# EAGLE design max30105_iiT (EAGLE 7.7.0)
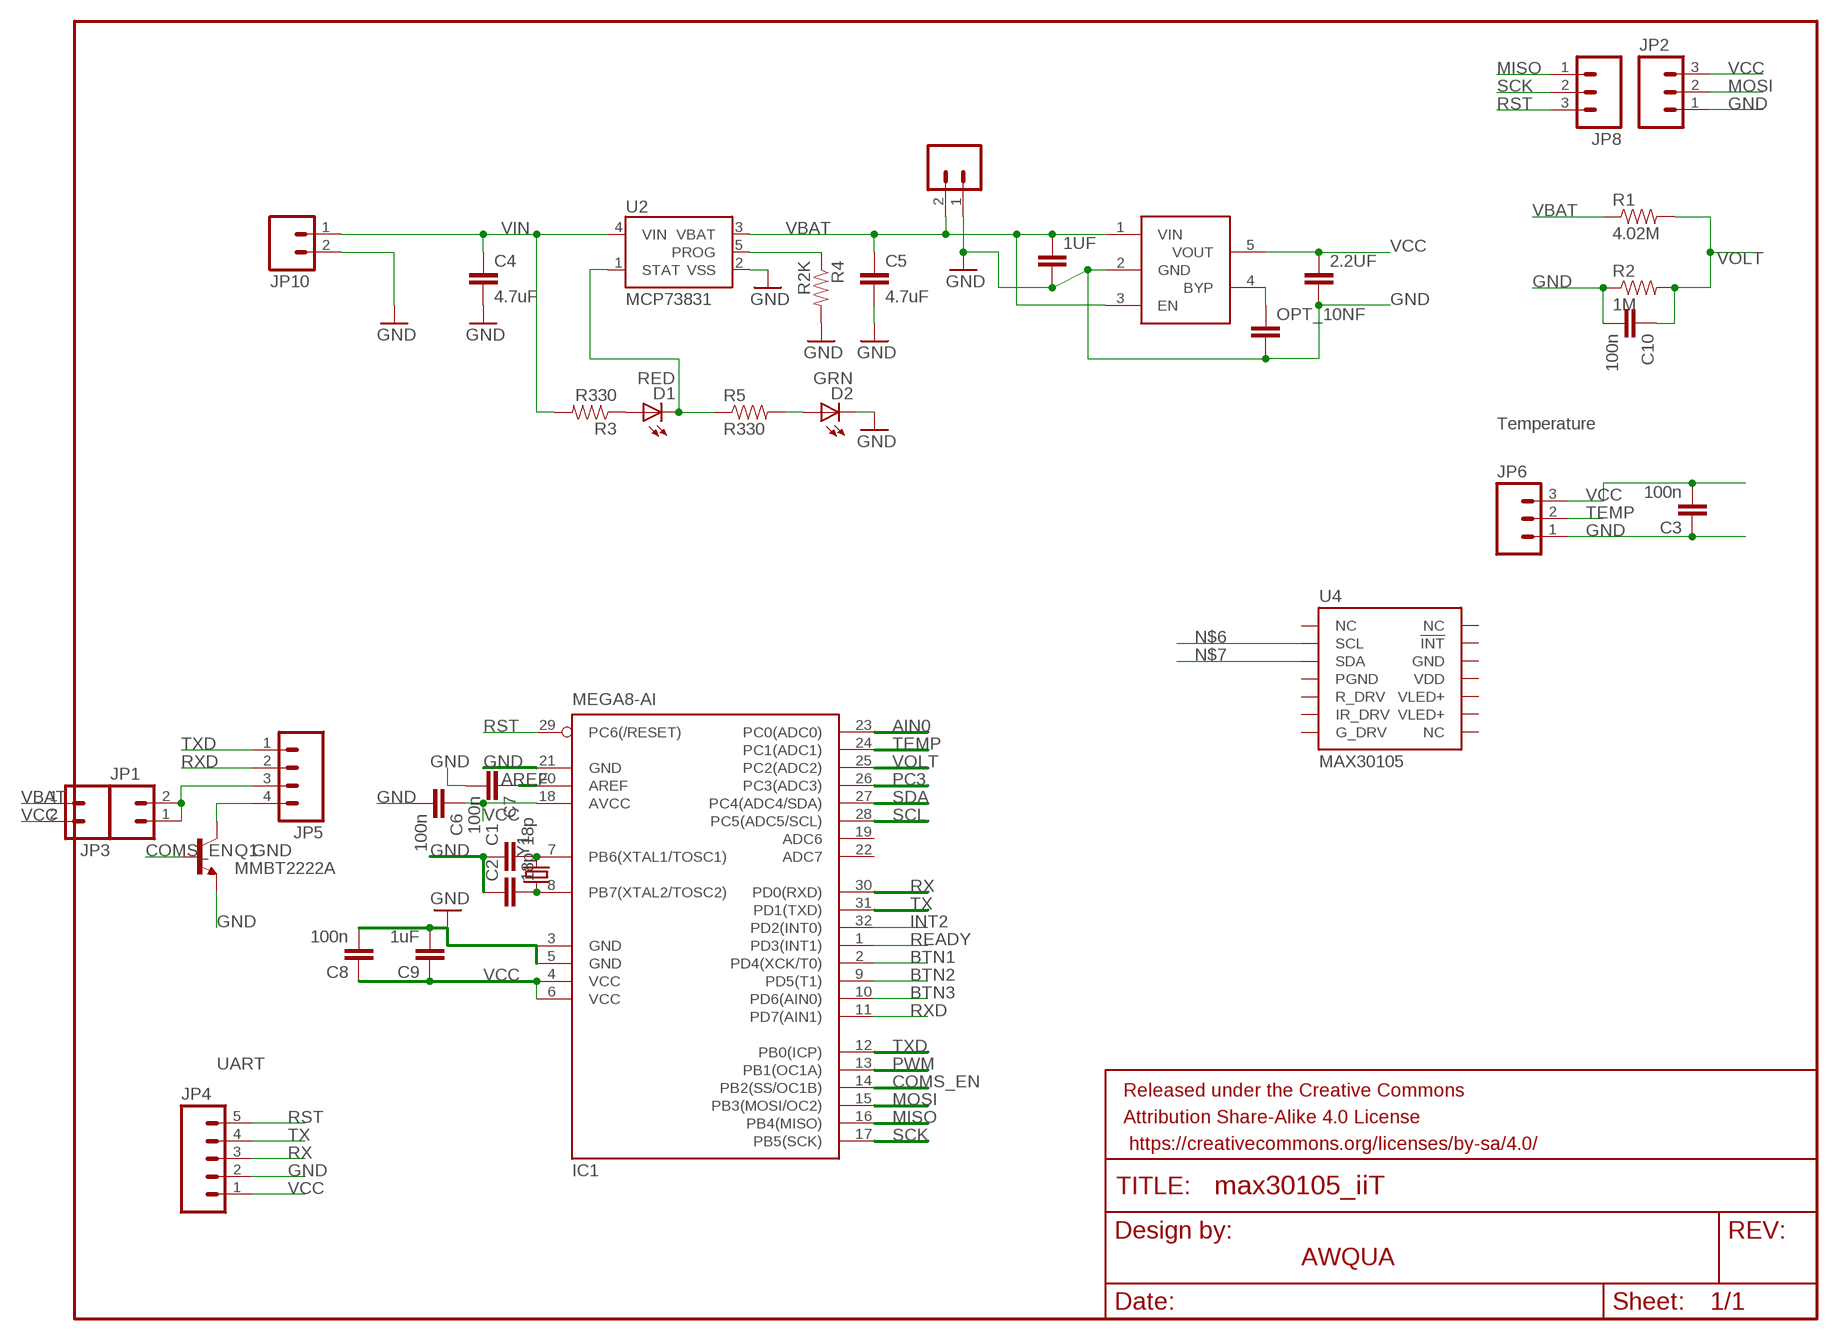
[diagram p0: schematic, sheet 1]

## Parts
1UF  CAP0603-CAP  [0603-CAP]
2.2UF  CAP0603-CAP  [0603-CAP]
C1  18p  CAP0603-CAP  [0603-CAP]
C2  18p  CAP0603-CAP  [0603-CAP]
C3  100n  CAP0603-CAP  [0603-CAP]
C4  4.7uF  CAP0402-CAP  [0402-CAP]
C5  4.7uF  CAP0402-CAP  [0402-CAP]
C6  100n  CAP0603-CAP  [0603-CAP]
C7  100n  CAP0603-CAP  [0603-CAP]
C8  100n  CAP0603-CAP  [0603-CAP]
C9  1uF  CAP0603-CAP  [0603-CAP]
C10  100n  CAP0603-CAP  [0603-CAP]
D1  RED  LED0603  [LED-0603]
D2  GRN  LED0603  [LED-0603]
FRAME1  FRAME-LETTER  [CREATIVE_COMMONS]
IC1  MEGA8-AI  [TQFP32-08]
JP1  M02PTH  [1X02]
JP2  M03PTH  [1X03]
JP3  M02PTH  [1X02]
JP4  M05PTH  [1X05]
JP5  M04PTH  [1X04]
JP6  M03PTH  [1X03]
JP7  LiPo Battery  M02-JST-2MM-SMT  [JST-2-SMD]
JP8  M03PTH  [1X03]
JP10  M02PTH  [1X02]
OPT_10NF  CAP0603-CAP  [0603-CAP]
Q1  MMBT2222A  TRANSISTOR_NPNMMBT2222A  [SOT23-3]
R1  4.02M  RESISTOR0603  [0603-RES]
R2  1M  RESISTOR0603  [0603-RES]
R3  R330  RESISTOR0402-RES  [0402-RES]
R4  R2K  RESISTOR0402-RES  [0402-RES]
R5  R330  RESISTOR0402-RES  [0402-RES]
U2  MCP73831  [SOT23-5]
U4  MAX30105  MAX30105SMD  [OLGA-14]
U$6  LP2985  [LP2985]
Y1  CRYSTAL5X3  [CRYSTAL-SMD-5X3]

## Nets
AIN0: IC1.23(PC0(ADC0))
AREF: C7.1 IC1.20(AREF)
BTN1: IC1.2(PD4(XCK/T0))
BTN2: IC1.9(PD5(T1))
BTN3: IC1.10(PD6(AIN0))
COMS_EN: IC1.14(PB2(SS/OC1B)) Q1.1(B)
GND: 1UF.2 2.2UF.2 C1.1 C2.1 C3.1 C4.2 C5.2 C6.2 C7.2 C8.2 C9.2 C10.2 D2.C IC1.3(GND) IC1.5(GND) IC1.21(GND) JP2.1 JP4.2 JP5.4 JP6.1 JP7.1 JP10.2 OPT_10NF.2 Q1.2(E) Q1.3(C) R2.1 R4.2 U2.2(VSS) U$6.2(GND)
INT2: IC1.32(PD2(INT0))
MISO: IC1.16(PB4(MISO)) JP8.1
MOSI: IC1.15(PB3(MOSI/OC2)) JP2.2
N$1: D1.A R3.1
N$2: OPT_10NF.1 U$6.4(BYP)
N$3: JP1.1 JP1.2 JP5.3
N$5: D2.A R5.2
N$6: U4.2(SCL)
N$7: U4.3(SDA)
PC3: IC1.26(PC3(ADC3))
PROG: R4.1 U2.5(PROG)
PWM: IC1.13(PB1(OC1A))
Q1: C2.2 IC1.8(PB7(XTAL2/TOSC2)) Y1.1
Q2: C1.2 IC1.7(PB6(XTAL1/TOSC1)) Y1.3
READY: IC1.1(PD3(INT1))
RST: IC1.29(PC6(/RESET)) JP4.5 JP8.3
RX: IC1.30(PD0(RXD)) JP4.3
RXD: IC1.11(PD7(AIN1)) JP5.2
SCK: IC1.17(PB5(SCK)) JP8.2
SCL: IC1.28(PC5(ADC5/SCL))
SDA: IC1.27(PC4(ADC4/SDA))
STAT: D1.C R5.1 U2.1(STAT)
TEMP: IC1.24(PC1(ADC1)) JP6.2
TX: IC1.31(PD1(TXD)) JP4.4
TXD: IC1.12(PB0(ICP)) JP5.1
VBAT: 1UF.1 C5.1 JP3.1 JP7.2 R1.1 U2.3(VBAT) U$6.1(VIN) U$6.3(EN)
VCC: 2.2UF.1 C3.2 C6.1 C8.1 C9.1 IC1.4(VCC) IC1.6(VCC) IC1.18(AVCC) JP2.3 JP3.2 JP4.1 JP6.3 U$6.5(VOUT)
VIN: C4.1 JP10.1 R3.2 U2.4(VIN)
VOLT: C10.1 IC1.25(PC2(ADC2)) R1.2 R2.2
Unconnected: IC1.19(ADC6) IC1.22(ADC7) U4.1(NC) U4.4(PGND) U4.5(R_DRV) U4.6(IR_DRV) U4.7(G_DRV) U4.8(NC) U4.9(VLED+) U4.10(VLED+) U4.11(VDD) U4.12(GND) U4.13(!INT) U4.14(NC)

## Notes on the sheet
- Temperature
- UART
- AWQUA

## Library data of the parts
1UF 2.2UF OPT_10NF = SparkFun-Passives:CAP: Capacitor Standard 0603 ceramic capacitor, and 0.1" leaded capacitor.
C1-C10 = SparkFun:CAP: Capacitor Standard 0603 ceramic capacitor, and 0.1" leaded capacitor.
D1 D2 = SparkFun:LED: LEDs Standard schematic elements and footprints for 5mm, 3mm, 1206, and 0603 sized LEDs. 5mm - Spark Fun Electronics SKU : COM-00529 (and others)
FRAME1 = SparkFun-Aesthetics:FRAME-LETTER: Schematic Frame Standard 8.5x11 US Letter frame
IC1 = atmel:MEGA8: MICROCONTROLLER 8 Kbytes FLASH, 1 kbytes SRAM, 512 bytes EEPROM, USART, 6-channel 10 bit ADC, 2-channel 8 bit ADC Pin compatible with Atmega48, ATMega88, ATMega168 Source: avr.lbr; MPN: ATMEGA8-16AU; OC_FARNELL: 9171371; OC_NEWARK: 73M8863
JP1 JP3 JP10 = SparkFun-Connectors:M02: Standard 2-pin 0.1" header. Use with - straight break away headers ( PRT-00116) - right angle break away headers (PRT-00553) - swiss pins (PRT-00743) - machine pins (PRT-00117) - female headers (PRT-00115) Molex polarized connector foot print use with: PRT-08233 with associated crimp pins and housings. 2.54_SCREWTERM for use with PRT-10571. 3.5mm Screw Terminal footprints for PRT-08084 5mm Screw Terminal footprints for use with PRT-08432
JP2 JP6 JP8 = SparkFun-Connectors:M03: Header 3 Standard 3-pin 0.1" header. Use with straight break away headers (SKU : PRT-00116), right angle break away headers (PRT-00553), swiss pins (PRT-00743), machine pins (PRT-00117), and female headers (PRT-00115). Molex polarized connector foot print use with SKU : PRT-08232 with associated crimp pins and housings.
JP4 = SparkFun-Connectors:M05: Header 5 Standard 5-pin 0.1" header. Use with straight break away headers (SKU : PRT-00116), right angle break away headers (PRT-00553), swiss pins (PRT-00743), machine pins (PRT-00117), and female headers (PRT-00115). Molex polarized connector foot print use with SKU : PRT-08230 with associated crimp pins and housings.
JP5 = SparkFun-Connectors:M04: Header 4 Standard 4-pin 0.1" header. Use with straight break away headers (SKU : PRT-00116), right angle break away headers (PRT-00553), swiss pins (PRT-00743), machine pins (PRT-00117), and female headers (PRT-00115). Molex polarized connector foot print use with SKU : PRT-08231 with associated crimp pins and housings. 1MM SMD Version SKU: PRT-10208
JP7 = SparkFun:M02: Header 2 Standard 2-pin 0.1" header. Use with straight break away headers (SKU : PRT-00116), right angle break away headers (PRT-00553), swiss pins (PRT-00743), machine pins (PRT-00117), and female headers (PRT-00115). Molex polarized connector foot print use with SKU : PRT-08233 with associated crimp pins and housings.
Q1 = SparkFun-DiscreteSemi:TRANSISTOR_NPN: Generic NPN BJT MMBT2222A - TRANS-08049 (SOT-23, 1A 40V) MPSA42 - TRANS-09116 (SOT-23, 500mA 300V) MMBT5088LT1G - TRANS-11160 (SOT-23, 50 mA 30V) BC547 - COM-08928 <http://www.sparkfun.com/products/8928> (TO-92 45V 100mA) (1.Collector 2.Base 3.Emitter) 2N3904 - COM-00521 <http://www.sparkfun.com/products/521> (TO-92 40V 200mA) (1.Emitter 2.Base 3.Collector) P2N2222A - COM-12852 <http://www.sparkfun.com/products/12852> (TO-92 40V 600mA) (1.Collector 2.Base 3.Emitter); PROD_ID: TRANS-08049
R1 R2 = SparkFun-Resistors:RESISTOR: Resistor Basic schematic elements and footprints for 0603, 1206, and PTH resistors.
R3-R5 = SparkFun:RESISTOR: Resistor Basic schematic elements and footprints for 0603, 1206, and PTH resistors.
U2 = SparkFun:MCP73831: Microchip's MCP73831 Miniature single cell, fully integrated Li-Ion, Li-polymer charge management controller http://ww1.microchip.com/downloads/en/DeviceDoc/21984a.pdf
U4 = MAX30105:MAX30105: Description: Particle Detection IC. Primarily used for smoke detection, can be used for Pulse Detection, Pulse Ox, and possible visual particle detection.; PROD_ID: IC-13510
U$6 = awqua_eagle_library:LP2985
Y1 = SparkFun:CRYSTAL: Crystals Various standard crystals. Proven footprints. Spark Fun Electronics SKU : COM-00534

## Board
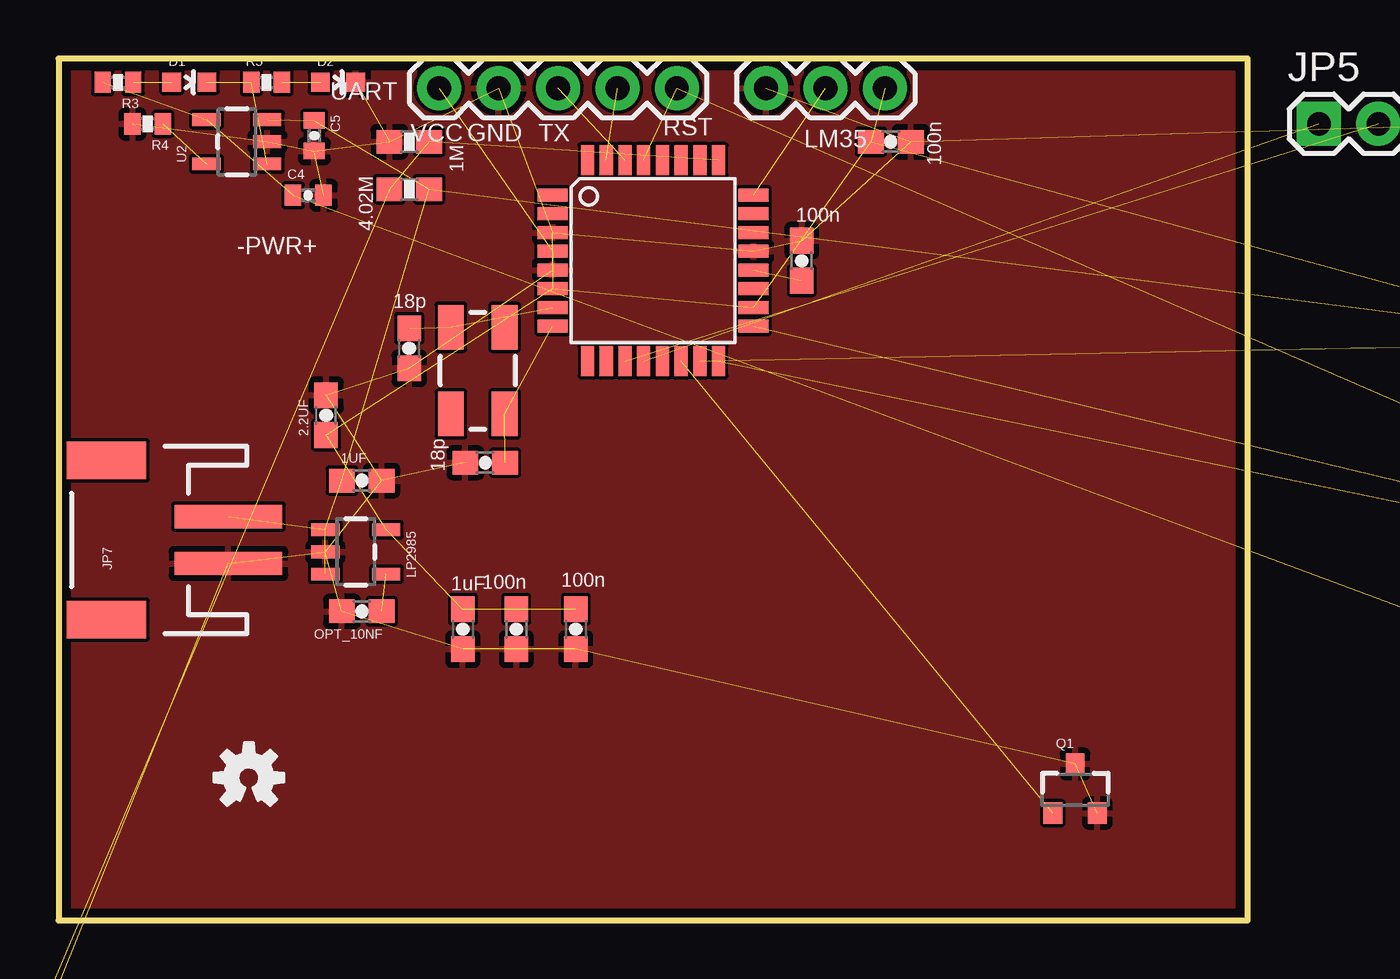
[diagram p1: board, top side]
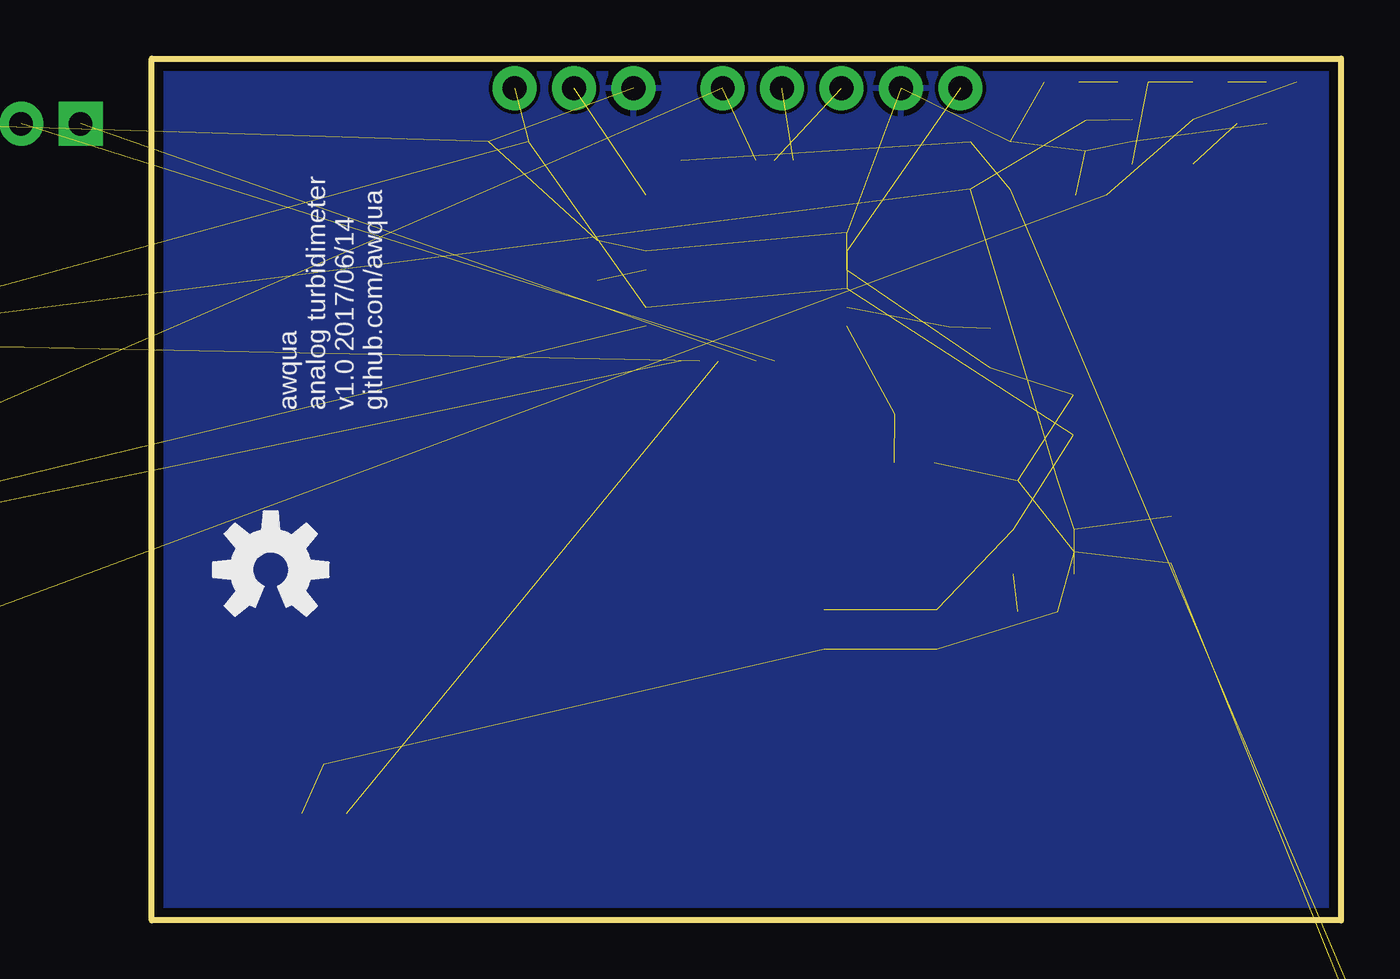
[diagram p2: board, bottom side, seen from below]

Size 50.8 x 36.83 mm. Coordinates in mm from the lower left corner, seen from the top.
Outline: 0,0 50.8,0 50.8,36.83 0,36.83 0,0
Copper layers (1*16): Top 0.0356mm / dielectric 1.5011mm / Bottom 0.0356mm
Design rules "default *": minimum track width 6mil, minimum drill 13mil, track to track 6mil, track to pad 6mil, pad to pad 6mil, via to via 6mil, smd to smd 6mil, copper to edge 15mil, drill to drill 6mil, minimum pad ring 7mil, minimum via ring 7mil, stop-mask expansion 4mil, vias tented up to drill 15mil, thermal gap 10mil

### Footprints (pad centres in the part's own frame; a part is rotated, then mirrored left to right if it is on the bottom)
0603-CAP = smd 1.1 x 1: 1 -0.85,0; 2 0.85,0
0402-CAP = smd 0.7 x 0.9: 1 -0.65,0; 2 0.65,0
LED-0603 = smd 0.8 x 0.8: A 0,-0.75; C 0,0.75
TQFP32-08 = smd 1.27 x 0.559: 1 -4.293,2.8; 2 -4.293,2; 3 -4.293,1.2; 4 -4.293,0.4; 5 -4.293,-0.4; 6 -4.293,-1.2; 7 -4.293,-2; 8 -4.293,-2.8; 17 4.293,-2.8; 18 4.293,-2; 19 4.293,-1.2; 20 4.293,-0.4; 21 4.293,0.4; 22 4.293,1.2; 23 4.293,2; 24 4.293,2.8 | smd 0.559 x 1.27: 9 -2.8,-4.293; 10 -2,-4.293; 11 -1.2,-4.293; 12 -0.4,-4.293; 13 0.4,-4.293; 14 1.2,-4.293; 15 2,-4.293; 16 2.8,-4.293; 25 2.8,4.293; 26 2,4.293; 27 1.2,4.293; 28 0.4,4.293; 29 -0.4,4.293; 30 -1.2,4.293; 31 -2,4.293; 32 -2.8,4.293
1X02 = drill 1.016 pad 1.88: 1 0,0; 2 2.54,0
1X03 = drill 1.016 pad 1.88: 1 0,0; 2 2.54,0; 3 5.08,0
1X05 = drill 1.016 pad 1.88: 1 0,0; 2 2.54,0; 3 5.08,0; 4 7.62,0; 5 10.16,0
1X04 = drill 1.016 pad 1.88 square: 1 0,0 | drill 1.016 pad 1.88: 2 2.54,0; 3 5.08,0; 4 7.62,0
JST-2-SMD = smd 1 x 4.6: 1 -1,-3.7; 2 1,-3.7 | smd 1.6 x 3.4: NC1 -3.4,1.5; NC2 3.4,1.5
SOT23-3 = smd 0.8 x 0.9: 1 -0.95,-1; 2 0.95,-1; 3 0,1.1
0603-RES = smd 1.1 x 1: 1 -0.85,0; 2 0.85,0
0402-RES = smd 0.7 x 0.9: 1 -0.65,0; 2 0.65,0
SOT23-5 = smd 0.55 x 1.2: 1 -0.95,-1.3; 2 0,-1.3; 3 0.95,-1.3; 4 0.95,1.3; 5 -0.95,1.3
OLGA-14 = smd 0.75 x 0.35: 1 -1.2,2.4; 2 -1.2,1.6; 3 -1.2,0.8; 4 -1.2,0; 5 -1.2,-0.8; 6 -1.2,-1.6; 7 -1.2,-2.4; 8 1.2,-2.4; 9 1.2,-1.6; 10 1.2,-0.8; 11 1.2,0; 12 1.2,0.8; 13 1.2,1.6; 14 1.2,2.4
LP2985 = smd 0.55 x 1.2: 1 0.32,-0.03; 2 1.27,-0.03; 3 2.22,-0.03; 4 2.22,2.57; 5 0.32,2.57
CRYSTAL-SMD-5X3 = smd 1.9 x 1.1: 1 -1.85,-1.15; 2 1.85,-1.15; 3 1.85,1.15; 4 -1.85,1.15

### Placement (x,y rotation side)
1UF  12.95,18.8 0 top
2.2UF  11.43,21.59 90 top
C1  14.99,24.45 90 top
C2  18.22,19.56 0 top
C3  35.56,33.27 180 top
C4  10.67,30.99 0 top
C5  10.92,33.53 270 top
C6  22.1,12.45 270 top
C7  31.75,28.19 90 top
C8  19.56,12.45 270 top
C9  17.27,12.45 270 top
C10  -26.92,-67.56 0 top  (outside the outline)
D1  5.59,35.81 270 top
D2  11.94,35.81 270 top
FRAME1  -0.64,-8.89 0 top  (outside the outline)
IC1  25.4,28.19 0 top
JP1  70.36,32.77 0 top  (outside the outline)
JP2  61.21,24.64 0 top  (outside the outline)
JP3  77.47,23.37 0 top  (outside the outline)
JP4  16.26,35.56 0 top
JP5  53.85,34.04 0 top  (outside the outline)
JP6  30.23,35.56 0 top
JP7  3.56,16.26 90 top
JP8  66.29,16 0 top  (outside the outline)
JP10  70.87,8.38 0 top  (outside the outline)
OPT_10NF  12.95,13.21 180 top
Q1  43.43,5.59 0 top
R1  14.99,31.24 180 top
R2  14.99,33.27 0 top
R3  2.54,35.81 180 top
R4  3.81,34.04 180 top
R5  8.89,35.81 0 top
U2  7.62,33.27 90 top
U4  -27.18,-62.23 0 top  (outside the outline)
U$4  [OSHW-LOGO-M]  45.72,14.99 0 bottom
U$5  [OSHW-LOGO-S]  8.13,6.1 0 top
U$6  11.43,17.02 270 top
Y1  17.91,23.5 90 top

### Tracks (layer width: path | path; a pad name or v marks a point on that pad's centre or on a via)
AREF  (1 unrouted)
COMS_EN  (1 unrouted)
GND  (28 unrouted)
  pour Top: 60.45,-4.32 -6.6,-3.56 -7.37,39.88 60.45,41.15
  pour Bottom: -5.08,39.12 53.85,39.62 52.58,-7.62 -6.1,-6.86
MISO  (1 unrouted)
MOSI  (1 unrouted)
N$1  (1 unrouted)
N$2  (1 unrouted)
N$3  (2 unrouted)
N$5  (1 unrouted)
PROG  (1 unrouted)
Q1  (2 unrouted)
Q2  (2 unrouted)
RST  (2 unrouted)
RX  (1 unrouted)
RXD  (1 unrouted)
SCK  (1 unrouted)
STAT  (2 unrouted)
TEMP  (1 unrouted)
TX  (1 unrouted)
TXD  (1 unrouted)
VBAT  (7 unrouted)
VCC  (12 unrouted)
VIN  (3 unrouted)
VOLT  (3 unrouted)

### Text on the board
bPlace: awqua / analog turbidimeter / v1.0 2017/06/14 / github.com/awqua
tNames: UART | VCC | GND | TX | RST | LM35 | -PWR+ | AWQUA / Chris Kelley